# Altium schematic sheet MEZ_ALL_IND.SchDoc
size A4
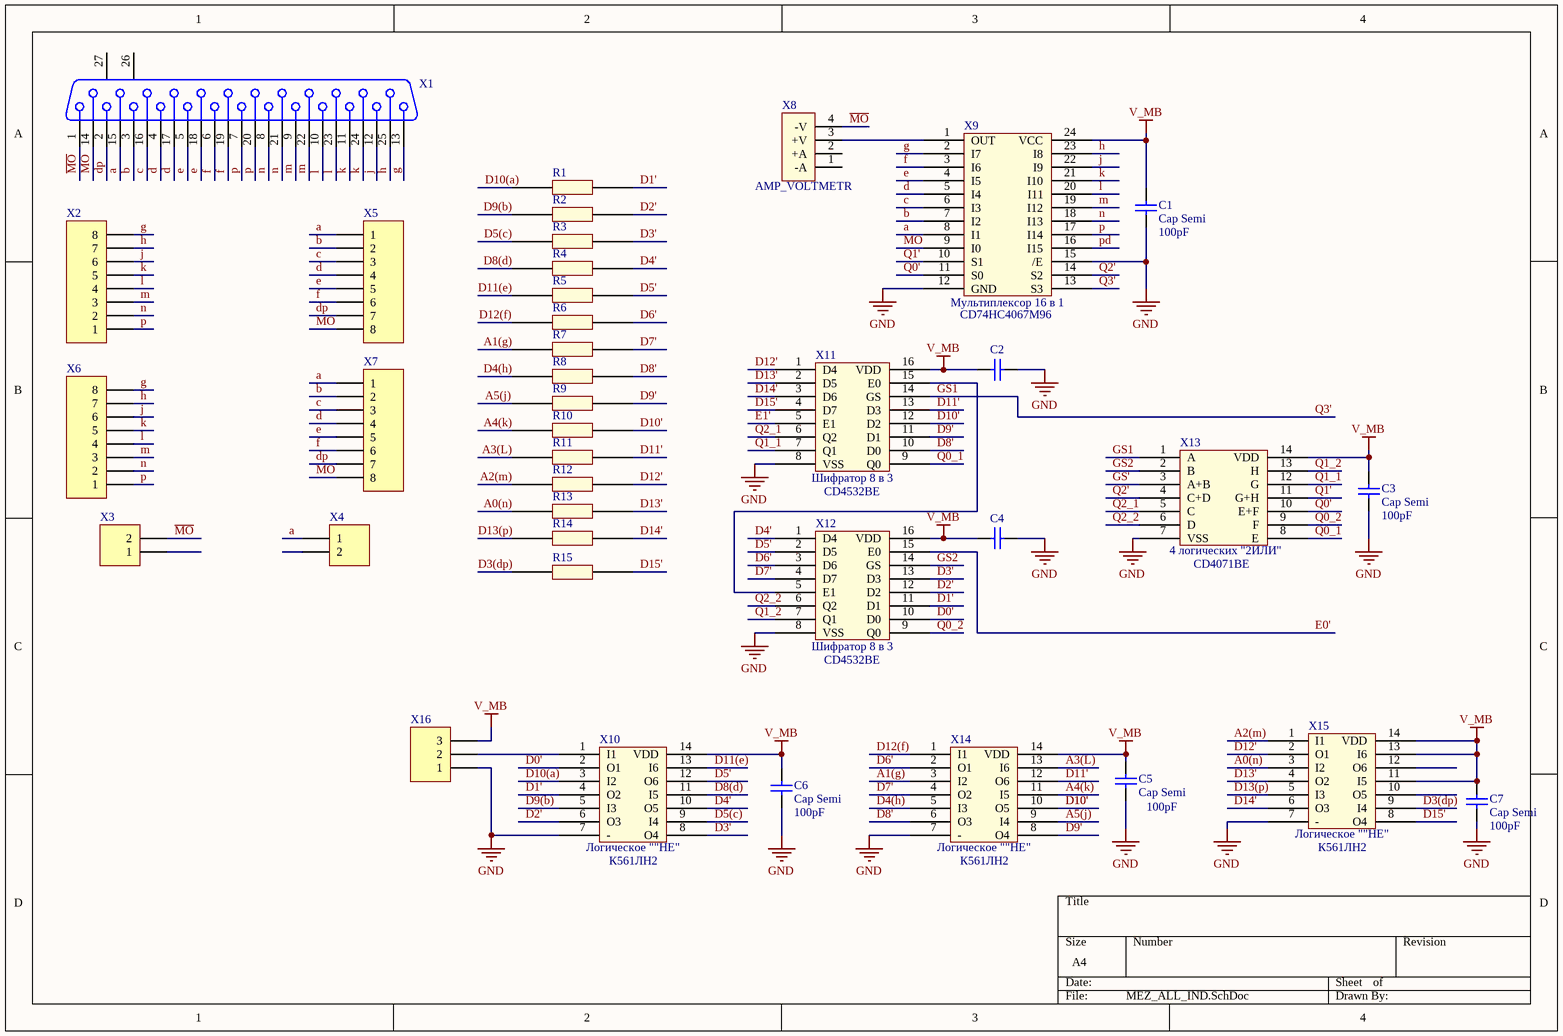
[diagram p0: MEZ_ALL_IND.SchDoc]

## Parts
C1  Cap Semi  value 100pF  [C1206]
C2  Cap Semi  [C1206]  (value not drawn)
C3  Cap Semi  value 100pF  [C1206]
C4  Cap Semi  [C1206]  (value not drawn)
C5  Cap Semi  value 100pF  [C1206]
C6  Cap Semi  value 100pF  [C1206]
C7  Cap Semi  value 100pF  [C1206]
R1  resistor  [RES 1608?]  (value not drawn)
R2  resistor  [RES 1608?]  (value not drawn)
R3  resistor  [RES 1608?]  (value not drawn)
R4  resistor  [RES 1608?]  (value not drawn)
R5  resistor  [RES 1608?]  (value not drawn)
R6  resistor  [RES 1608?]  (value not drawn)
R7  resistor  [RES 1608?]  (value not drawn)
R8  resistor  [RES 1608?]  (value not drawn)
R9  resistor  [RES 1608?]  (value not drawn)
R10  resistor  [RES 1608?]  (value not drawn)
R11  resistor  [RES 1608?]  (value not drawn)
R12  resistor  [RES 1608?]  (value not drawn)
R13  resistor  [RES 1608?]  (value not drawn)
R14  resistor  [RES 1608?]  (value not drawn)
R15  resistor  [RES 1608?]  (value not drawn)
X1  D Connector 25  [DSUB1.385-2H25A]  (value not drawn)
X2  Header 8  [HDR1X8]  (value not drawn)
X3  Header 2  [HDR1X2]  (value not drawn)
X4  Header 2  [HDR1X2]  (value not drawn)
X5  Header 8  [HDR1X8]  (value not drawn)
X6  Header 8  [HDR1X8]  (value not drawn)
X7  Header 8  [HDR1X8]  (value not drawn)
X8  AMP_VOLTMETR  [AMP_VOLTMETR]
X9  CD74HC4067M96  [SOIC-24]
X10  К561ЛН2
X11  CD4532BE
X12  CD4532BE
X13  CD4071BE
X14  К561ЛН2
X15  К561ЛН2
X16  Header 3  [HDR1X3]  (value not drawn)

## Nets
GND: C1.1 C2.1 C3.1 C4.1 C5.1 C6.1 C7.1 X9.12(GND) X9.15(/E) X10.7(-) X11.8(VSS) X12.8(VSS) X13.7(VSS) X14.7(-) X15.7(-) X16.1
V_MB: C1.2 C2.2 C3.2 C4.2 C5.2 C6.2 C7.2 X9.24(VCC) X10.14(VDD) X11.16(VDD) X12.16(VDD) X13.14(VDD) X14.14(VDD) X15.11(I5) X15.13(I6) X15.14(VDD) X16.3
~{MO}: X1.1 X1.14 X3.2 X5.8 X7.8 X8.4(-V) X9.9(I0)
a: X1.15 X4.1 X5.1 X7.1 X9.8(I1)
A0(n): R13.1 X15.3(I2)
A1(g): R7.1 X14.3(I2)
A2(m): R12.1 X15.1(I1)
A3(L): R11.1 X14.13(I6)
A4(k): R10.1 X14.11(I5)
A5(j): R9.1 X14.9(I4)
b: X1.3 X5.2 X7.2 X9.7(I2)
c: X1.16 X5.3 X7.3 X9.6(I3)
d: X1.4 X1.17 X5.4 X7.4 X9.5(I4)
D0': X10.2(O1) X12.10(D0)
D1': R1.2 X10.4(O2) X12.11(D1)
D2': R2.2 X10.6(O3) X12.12(D2)
D3': R3.2 X10.8(O4) X12.13(D3)
D3(dp): R15.1 X15.9(I4)
D4': R4.2 X10.10(O5) X12.1(D4)
D4(h): R8.1 X14.5(I3)
D5': R5.2 X10.12(O6) X12.2(D5)
D5(c): R3.1 X10.9(I4)
D6': R6.2 X12.3(D6) X14.2(O1)
D7': R7.2 X12.4(D7) X14.4(O2)
D8': R8.2 X11.10(D0) X14.6(O3)
D8(d): R4.1 X10.11(I5)
D9': R9.2 X11.11(D1) X14.8(O4)
D9(b): R2.1 X10.5(I3)
D10': R10.2 X11.12(D2) X14.10(O5)
D10(a): R1.1 X10.3(I2)
D11': R11.2 X11.13(D3) X14.12(O6)
D11(e): R5.1 X10.13(I6)
D12': R12.2 X11.1(D4) X15.2(O1)
D12(f): R6.1 X14.1(I1)
D13': R13.2 X11.2(D5) X15.4(O2)
D13(p): R14.1 X15.5(I3)
D14': R14.2 X11.3(D6) X15.6(O3)
D15': R15.2 X11.4(D7) X15.8(O4)
dp: X1.2 X5.7 X7.7
e: X1.5 X1.18 X5.5 X7.5 X9.4(I5)
E0': X12.15(E0)
E1': X11.5(E1)
f: X1.6 X1.19 X5.6 X7.6 X9.3(I6)
g: X1.13 X2.8 X6.8 X9.2(I7)
GS1: X9.13(S3) X11.14(GS) X13.1(A)  [also labelled Q3']
GS2: X12.14(GS) X13.2(B)
GS': X13.3(A+B)
h: X1.25 X2.7 X6.7 X9.23(I8)
j: X1.12 X2.6 X6.6 X9.22(I9)
k: X1.11 X1.24 X2.5 X6.5 X9.21(I10)
l: X1.10 X1.23 X2.4 X6.4 X9.20(I11)
m: X1.9 X1.22 X2.3 X6.3 X9.19(I12)
n: X1.8 X1.21 X2.2 X6.2 X9.18(I13)
p: X1.7 X1.20 X2.1 X6.1 X9.17(I14)
pd: X9.16(I15)
Q0': X9.11(S0) X13.10(E+F)
Q0_1: X11.9(Q0) X13.8(E)
Q0_2: X12.9(Q0) X13.9(F)
Q1': X9.10(S1) X13.11(G+H)
Q1_1: X11.7(Q1) X13.12(G)
Q1_2: X12.7(Q1) X13.13(H)
Q2': X9.14(S2) X13.4(C+D)
Q2_1: X11.6(Q2) X13.5(C)
Q2_2: X12.6(Q2) X13.6(D)
NetX8_3: X8.3(+V) X9.1(OUT)
NetX10_1: X10.1(I1) X16.2
NetX11_15: X11.15(E0) X12.5(E1)

Not connected (* = marked no-connect by the designer): X1 26(MH1) 27(MH2); X3 1; X4 2; X8 1(-A) 2(+A); X15 10(O5) 12(O6)

## Notes on the sheet
- (in symbol CD74HC4067M96) Мультиплексор 16 в 1
- (in symbol CD4071BE) 4 логических "2ИЛИ"
- (in symbol CD4532BE) Шифратор 8 в 3
- (in symbol К561ЛН2) Логическое ""НЕ"

## Library data of the parts
C1-C7 = Cap Semi: Capacitor (Semiconductor SIM Model); Published: 8-Jun-2000; LatestRevisionDate: 29-May-2009; LatestRevisionNote: IPC-7351 Footprint Added.; PackageReference: C1206; Publisher: Altium Limited; PackageDescription: Chip Capacitor
R1-R15 = RES
X1 = D Connector 25: Receptacle Assembly, 25 Position, Right Angle; PackageDocument: U; Positions: 25; Published: 15-Jun-2001; LatestRevisionDate: 17-Jul-2002; LatestRevisionNote: Re-released for DXP Platform.; DatasheetDocument: 19-Mar-1999; PackageReference: 787202; Publisher: Altium Limited; Orientation: Right Angle; Gender: Receptacle
X2 X5-X7 = Header 8: Header, 8-Pin; LatestRevisionDate: 17-Jul-2002; LatestRevisionNote: Re-released for DXP Platform.; Publisher: Altium Limited
X3 X4 = Header 2: Header, 2-Pin; LatestRevisionDate: 17-Jul-2002; LatestRevisionNote: Re-released for DXP Platform.; Publisher: Altium Limited
X9 = CD74HC4067M96: 16-и канальный аналоговый мультиплексор/ демультиплексор, [SO-24]
X10 X14 X15 = К561ЛН2: Шесть логических элементов "HЕ" (DIP-14)
X11 X12 = CD4532BE: Шифратор приоритетный 8 - 3 [DIP-16]
X13 = CD4071BE: Четыре логических элемента "2ИЛИ", [DIP-14]
X16 = Header 3: Header, 3-Pin; LatestRevisionDate: 17-Jul-2002; LatestRevisionNote: Re-released for DXP Platform.; Publisher: Altium Limited